# Altium schematic sheet 01.SchDoc
size A4
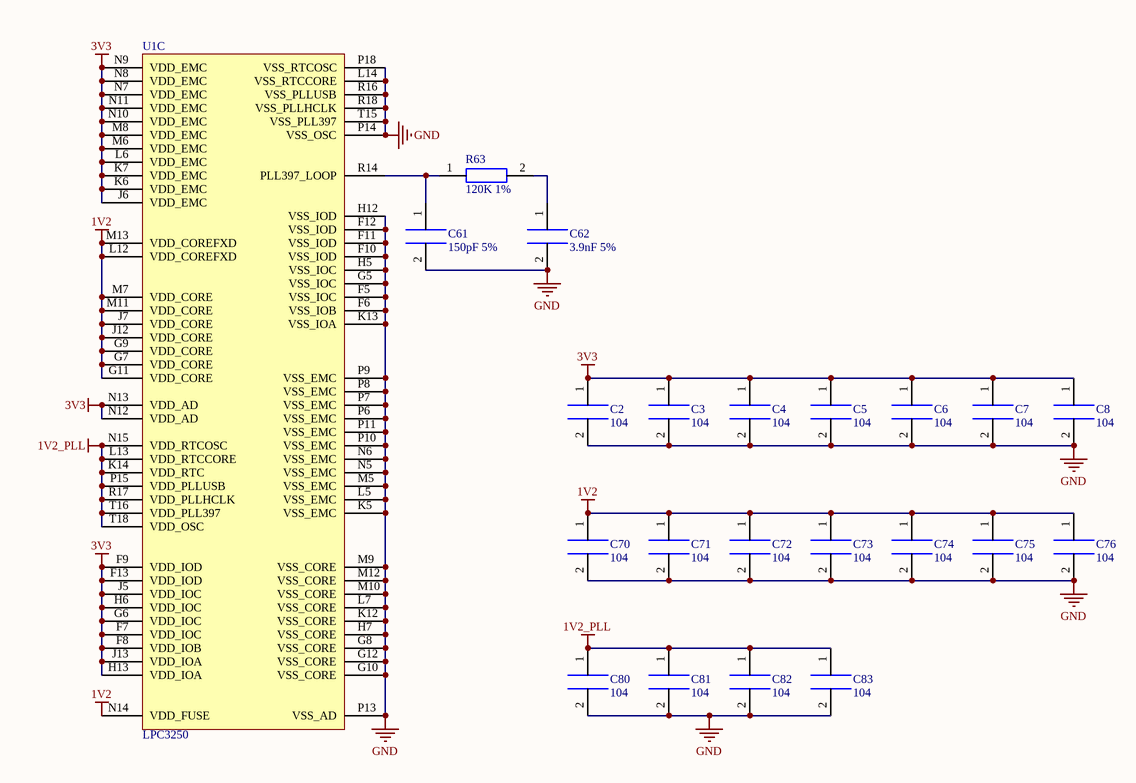
[diagram p0: 01.SchDoc]

## Parts
C2  104  [0603C]
C3  104  [0603C]
C4  104  [0603C]
C5  104  [0603C]
C6  104  [0603C]
C7  104  [0603C]
C8  104  [0603C]
C61  150pF 5%  [0603C]
C62  3.9nF 5%  [0603C]
C70  104  [0603C]
C71  104  [0603C]
C72  104  [0603C]
C73  104  [0603C]
C74  104  [0603C]
C75  104  [0603C]
C76  104  [0603C]
C80  104  [0603C]
C81  104  [0603C]
C82  104  [0603C]
C83  104  [0603C]
R63  120K 1%  [0603R]
U1  LPC3250  [TFBGA296]  (part C of 4)

## Nets
1V2: C70.1 C71.1 C72.1 C73.1 C74.1 C75.1 C76.1 U1.G7(VDD_CORE) U1.G9(VDD_CORE) U1.G11(VDD_CORE) U1.J7(VDD_CORE) U1.J12(VDD_CORE) U1.L12(VDD_COREFXD) U1.M7(VDD_CORE) U1.M11(VDD_CORE) U1.M13(VDD_COREFXD) U1.N14(VDD_FUSE)
1V2_PLL: C80.1 C81.1 C82.1 C83.1 U1.K14(VDD_RTC) U1.L13(VDD_RTCCORE) U1.N15(VDD_RTCOSC) U1.P15(VDD_PLLUSB) U1.R17(VDD_PLLHCLK) U1.T16(VDD_PLL397) U1.T18(VDD_OSC)
3V3: C2.1 C3.1 C4.1 C5.1 C6.1 C7.1 C8.1 U1.F7(VDD_IOC) U1.F8(VDD_IOB) U1.F9(VDD_IOD) U1.F13(VDD_IOD) U1.G6(VDD_IOC) U1.H6(VDD_IOC) U1.H13(VDD_IOA) U1.J5(VDD_IOC) U1.J6(VDD_EMC) U1.J13(VDD_IOA) U1.K6(VDD_EMC) U1.K7(VDD_EMC) U1.L6(VDD_EMC) U1.M6(VDD_EMC) U1.M8(VDD_EMC) U1.N7(VDD_EMC) U1.N8(VDD_EMC) U1.N9(VDD_EMC) U1.N10(VDD_EMC) U1.N11(VDD_EMC) U1.N12(VDD_AD) U1.N13(VDD_AD)
GND: C2.2 C3.2 C4.2 C5.2 C6.2 C7.2 C8.2 C61.2 C62.2 C70.2 C71.2 C72.2 C73.2 C74.2 C75.2 C76.2 C80.2 C81.2 C82.2 C83.2 U1.F5(VSS_IOC) U1.F6(VSS_IOB) U1.F10(VSS_IOD) U1.F11(VSS_IOD) U1.F12(VSS_IOD) U1.G5(VSS_IOC) U1.G8(VSS_CORE) U1.G10(VSS_CORE) U1.G12(VSS_CORE) U1.H5(VSS_IOC) U1.H7(VSS_CORE) U1.H12(VSS_IOD) U1.K5(VSS_EMC) U1.K12(VSS_CORE) U1.K13(VSS_IOA) U1.L5(VSS_EMC) U1.L7(VSS_CORE) U1.L14(VSS_RTCCORE) U1.M5(VSS_EMC) U1.M9(VSS_CORE) U1.M10(VSS_CORE) U1.M12(VSS_CORE) U1.N5(VSS_EMC) U1.N6(VSS_EMC) U1.P6(VSS_EMC) U1.P7(VSS_EMC) U1.P8(VSS_EMC) U1.P9(VSS_EMC) U1.P10(VSS_EMC) U1.P11(VSS_EMC) U1.P13(VSS_AD) U1.P14(VSS_OSC) U1.P18(VSS_RTCOSC) U1.R16(VSS_PLLUSB) U1.R18(VSS_PLLHCLK) U1.T15(VSS_PLL397)
NetC61_1: C61.1 R63.1 U1.R14(PLL397_LOOP)
NetC62_1: C62.1 R63.2

## Library data of the parts
C2-C8 C61 C62 C70-C76 C80-C83 = CAP
R63 = RES